# EasyEDA Pro project BLDC wireless project.eprj

# Schematic BLDC controller

## Sheets
1 Motor control: Create Date: 2022-08-15; Page Name: Motor control; Project Name: BLDC wireless project; Schematic Name: BLDC controller; Update Date: 2022-08-15
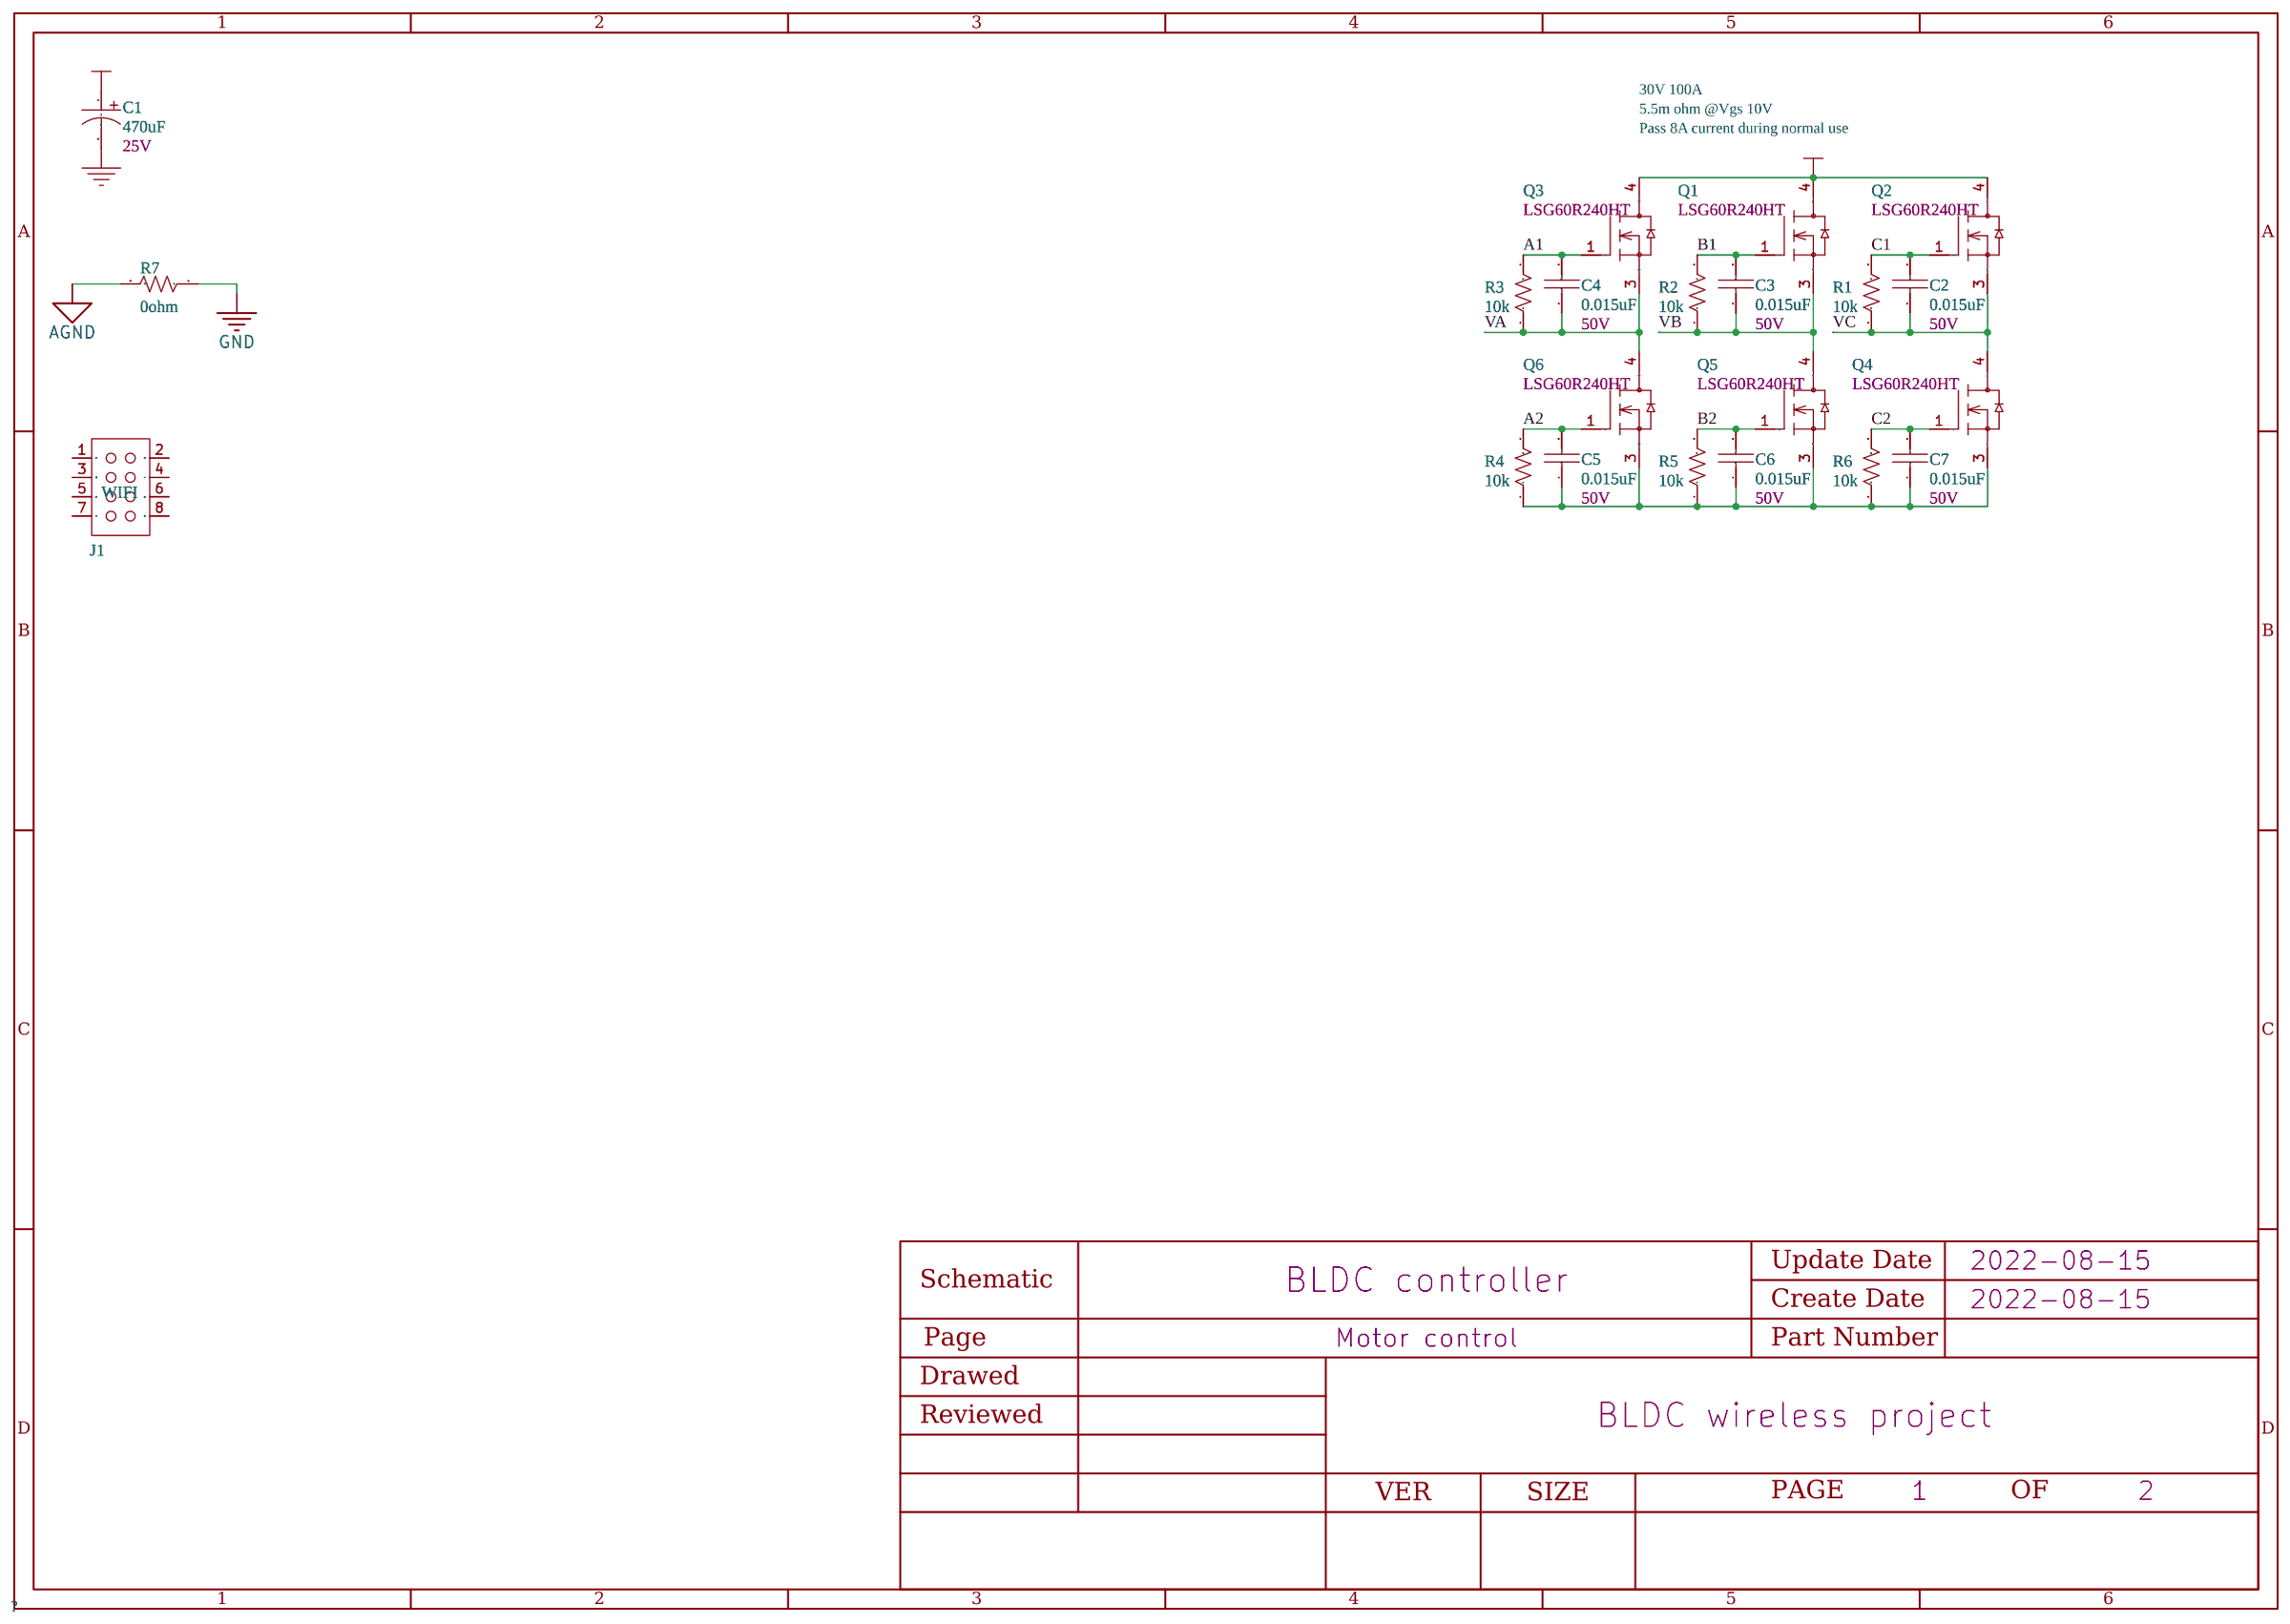
[diagram p0: Motor control]
2 EPS8266: Page Name: EPS8266
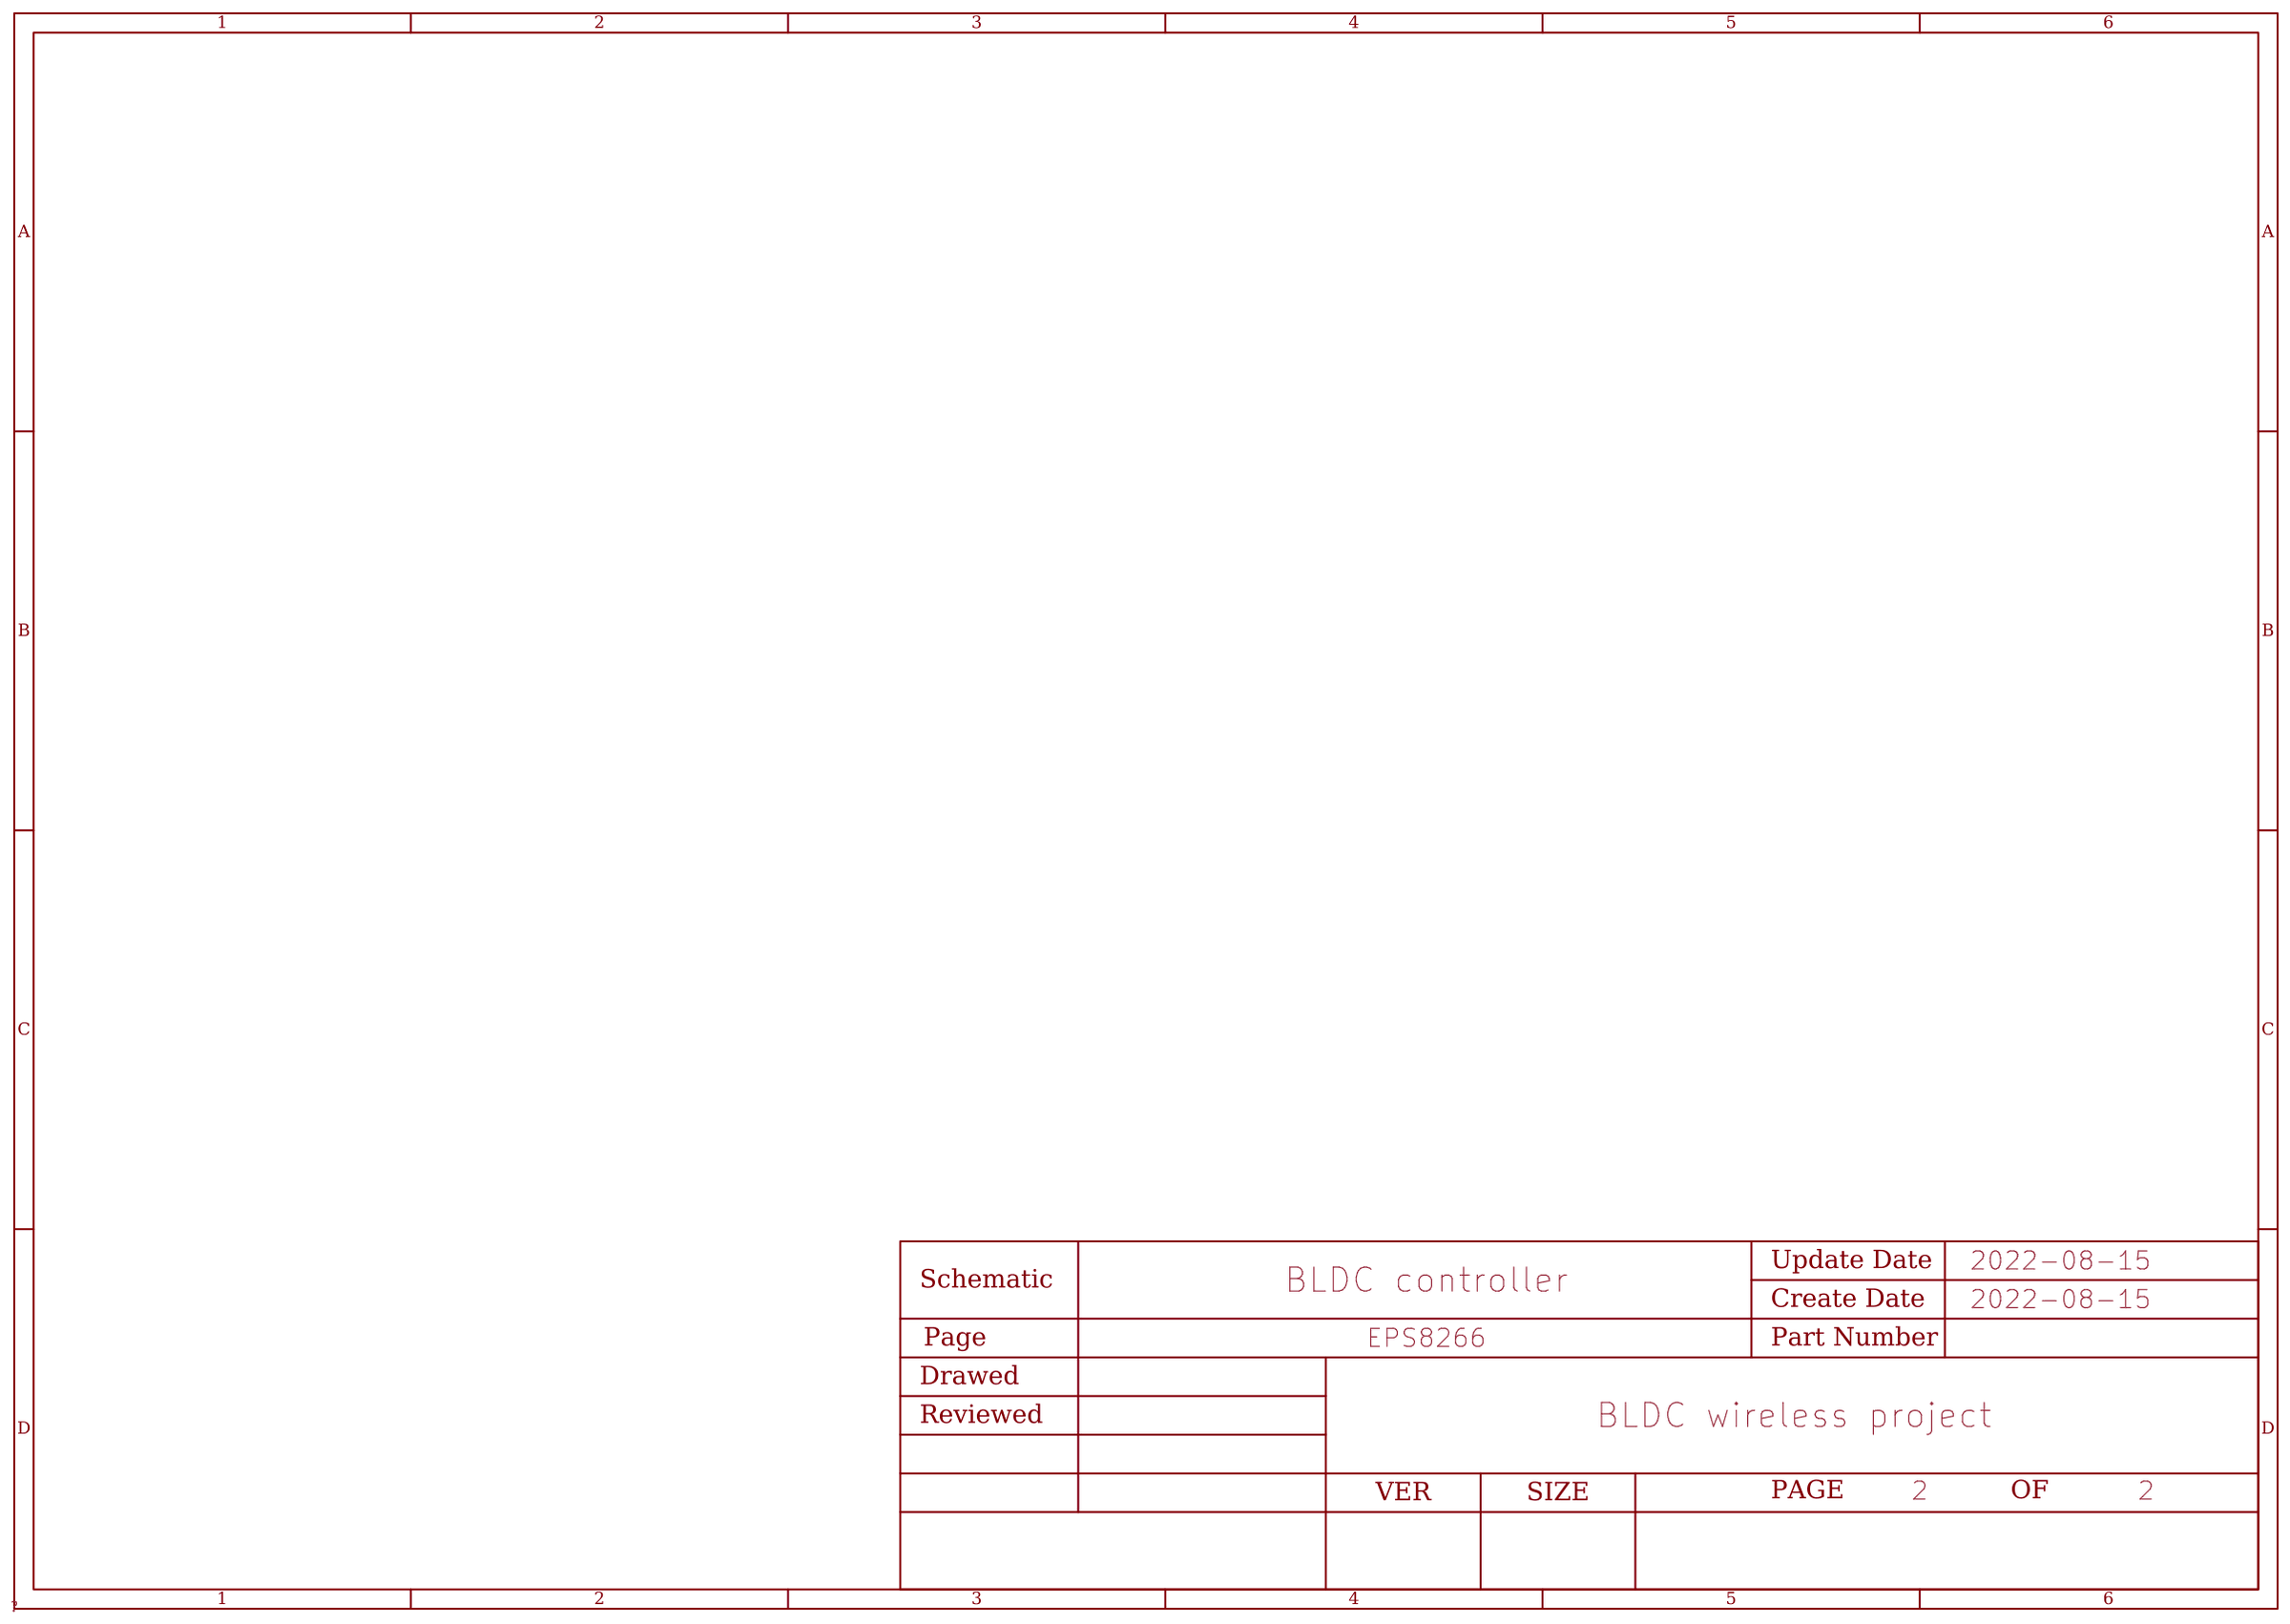
[diagram p1: EPS8266]

## Parts
C1  470uF
C2  0.015uF
C3  0.015uF
C4  0.015uF
C5  0.015uF
C6  0.015uF
C7  0.015uF
J1  2.54mm
Q1  T5860038503A6
Q2  T5860038503A6
Q3  T5860038503A6
Q4  T5860038503A6
Q5  T5860038503A6
Q6  T5860038503A6
R1  10k
R2  10k
R3  10k
R4  10k
R5  10k
R6  10k
R7  0ohm

## Library data of the parts
C1 = PBE099550-4710: CHIP ELECT 470uF 25V 20% D10xL10 105; SAP: T551471445000; Vendor Name: 涓滆帪甯傛櫞杩滅數瀛愭湁闄愬叕鍙竱; Vendor Code: 10010262; MFG: *; MFG Part: *; Other: *; Tolerance: 20%; Type: Capacitor; DIP&SMD: SMD; Customer Specific: N/A; Voltage: 25V
C2-C7 = PXL456470-1530: GP CHIP CAP 0.015uF 50V 10% 0603 TYPE X7R; SAP: T542021537508; Vendor Code: 10010262; Vendor Name: 涓滆帪甯傛櫞杩滅數瀛愭湁闄愬叕鍙竱; MFG: *; MFG Part: *; Other: X7R; Tolerance: 10%; Type: Capacitor; DIP&SMD: SMD; Customer Specific: N/A; Voltage: 50V; Origin Footprint 2: CAPC0603-SW; Origin Footprint 1: CAPC0603-RW
J1 = WIFI: 2X4P P:2.54MM 90掳 DIP K; SAP: T690300110000; MFG: JINJIA; MFG Part: 2.54-2X4AW-10.4; Vendor Name: *; Vendor Code: *; Type: Connector; Current: *; CREATE_TIME: 12-Sep-2017; CREATE_NAME: Nathan; DIP&SMD: DIP
Q1-Q6 = T5860038503A6: NMOS 600V LSG60R240HT TO252( LONTEN K; Pd: *; Vendor Code: *; Vendor Name: *; Voltage: 600V; MFG: LONTEN; CREATE_TIME: 12-Oct-2019; Rds: *; Current: 17A; Type: N-CHANNEL MOSFET; CREATE_NAME: Nathan; DIP&SMD: SMD; Customer Specific: N/A; MFG Part: LSG60R240HT
R1-R7 = T5024421083A9: CHIP 4.42K OHM 200PPM +-1% 0201 WALS L; Vendor Code: *; Power: 1/20W; Vendor Name: *; MFG Part: WR02X4421FAL; MFG: WALSIN (鑿柊); TOL: 1%; Type: Resistor; CREATE_NAME: Nathan; CREATE_TIME: 23-July-2019; DIP&SMD: SMD; Customer Specific: N/A

## Nets
AGND: R7.2
GND: C1.2 R7.1
A1: C4.2 Q3.1(G) R3.2
A2: C5.2 Q6.1(G) R4.2
B1: C3.2 Q1.1(G) R2.2
B2: C6.2 Q5.1(G) R5.2
C1: C2.2 Q2.1(G) R1.2
C2: C7.2 Q4.1(G) R6.2
V_BAT: C1.1 Q1.4(D) Q2.4(D) Q3.4(D)
VA: C4.1 Q3.3(S) Q6.4(D) R3.1
VB: C3.1 Q1.3(S) Q5.4(D) R2.1
VC: C2.1 Q2.3(S) Q4.4(D) R1.1
Net-(C5-1): C5.1 C6.1 C7.1 Q4.3(S) Q5.3(S) Q6.3(S) R4.1 R5.1 R6.1

Not connected (* = marked no-connect by the designer): J1 1 2 3 4 5 6 7 8

## Notes on the sheets
sheet 1
- 30V 100A
- 5.5m ohm @Vgs 10V
- Pass 8A current during normal use
